# EAGLE design PHAS-AmpController (EAGLE 9.0.1)
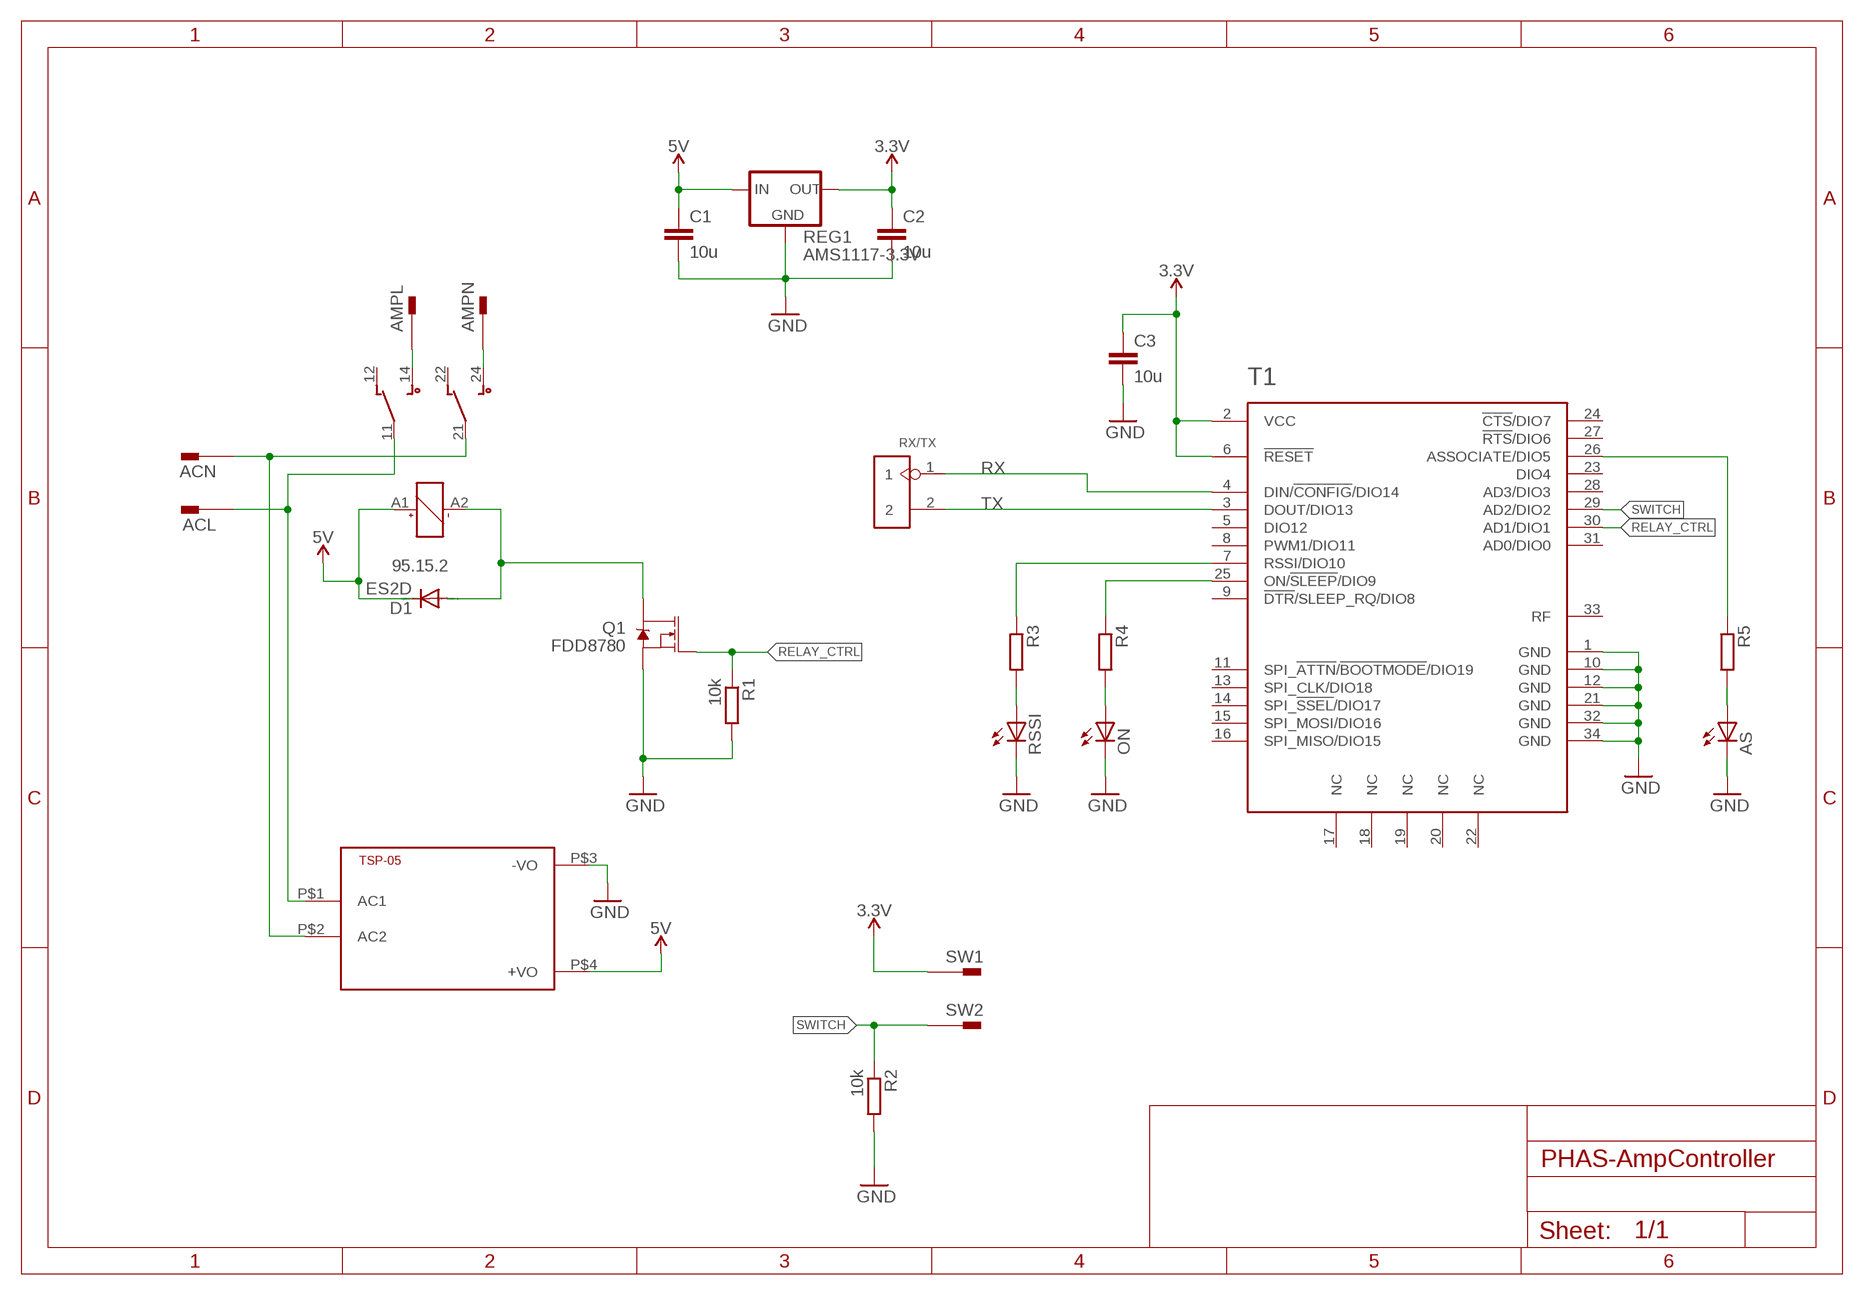
[diagram p0: schematic, sheet 1]

## Parts
ACL  PIN2F061.100  [F061.100]
ACN  PIN2F061.100  [F061.100]
AMPL  PIN2F061.100  [F061.100]
AMPN  PIN2F061.100  [F061.100]
AS  LEDCHIPLED_0805  [CHIPLED_0805]
C1  10u  C-EUC0805  [C0805]
C2  10u  C-EUC0805  [C0805]
C3  10u  C-EUC0805  [C0805]
D1  ES2D  [SMB]
ON  LEDCHIPLED_0805  [CHIPLED_0805]
Q1  FDD8780  MOSFET-NCH-FDD8780  [DPAK]
R1  10k  R-EU_R0805  [R0805]
R2  10k  R-EU_R0805  [R0805]
R3  R-EU_R0805  [R0805]
R4  R-EU_R0805  [R0805]
R5  R-EU_R0805  [R0805]
REG1  AMS1117-3.3V  LM1117MP-3.3  [SOT223]
RL1  95.15.2  [95.15.2]
RSSI  LEDCHIPLED_0805  [CHIPLED_0805]
RX/TX  DIP-BLACK-MALE-HEADER-VERT(2P-2.54)  [H2-2.54]
SW1  PIN2F061.100  [F061.100]
SW2  PIN2F061.100  [F061.100]
T1  XBEE3-MICRO  [XBEE3-MICRO]
TSP-05  HKLPM01  [HKLPM01]

## Nets
3.3V: C2.1 C3.1 REG1.2(OUT) REG1.4(OUT) SW1.A1 SW1.A2 T1.2(VCC) T1.6(!RESET!)
5V: C1.1 D1.C REG1.3(IN) RL1.A1 TSP-05.P$4(+VO)
GND: AS.C C1.2 C2.2 C3.2 ON.C Q1.3(S) R1.2 R2.2 REG1.1(GND) RSSI.C T1.1(GND) T1.10(GND) T1.12(GND) T1.21(GND) T1.32(GND) T1.34(GND) TSP-05.P$3(-VO)
N$2: ACL.A1 ACL.A2 RL1.11 TSP-05.P$1(AC1)
N$3: R3.2 RSSI.A
N$4: ON.A R4.2
N$5: D1.A Q1.4(D) RL1.A2
N$6: AS.A R5.2
N$7: R3.1 T1.7(RSSI/DIO10)
N$8: R4.1 T1.25(ON/!SLEEP!/DIO9)
N$9: R5.1 T1.26(ASSOCIATE/DIO5)
N$10: AMPL.A1 AMPL.A2 RL1.14
N$11: AMPN.A1 AMPN.A2 RL1.24
N$13: ACN.A1 ACN.A2 RL1.21 TSP-05.P$2(AC2)
RELAY_CTRL: Q1.1(G) R1.1 T1.30(AD1/DIO1)
RX: RX/TX.1 T1.4(DIN/!CONFIG!/DIO14)
SWITCH: R2.1 SW2.A1 SW2.A2 T1.29(AD2/DIO2)
TX: RX/TX.2 T1.3(DOUT/DIO13)
Unconnected: RL1.12 RL1.22 T1.5(DIO12) T1.8(PWM1/DIO11) T1.9(!DTR!/SLEEP_RQ/DIO8) T1.11(SPI_!ATTN!/!BOOTMODE!/DIO19) T1.13(SPI_CLK/DIO18) T1.14(SPI_!SSEL!/DIO17) T1.15(SPI_MOSI/DIO16) T1.16(SPI_MISO/DIO15) T1.17(NC) T1.18(NC) T1.19(NC) T1.20(NC) T1.22(NC) T1.23(DIO4) T1.24(!CTS!/DIO7) T1.27(!RTS!/DIO6) T1.28(AD3/DIO3) T1.31(AD0/DIO0) T1.33(RF)

## Library data of the parts
ACL ACN AMPL AMPN SW1 SW2 = con-faston:PIN2: Flachstecker Typ Tyco/Electronics/AMP TAB, FASTON Printed Circuit Board Tabs Source: http://www.buerklin.com, http://catalog.tycoelectronics.com; OC_FARNELL: unknown; OC_NEWARK: unknown
AS ON RSSI = led:LED: LED OSRAM: - CHIPLED LG R971, LG N971, LY N971, LG Q971, LY Q971, LO R971, LY R971 LH N974, LH R974 LS Q976, LO Q976, LY Q976 LO Q996 - Hyper CHIPLED LW Q18S LB Q993, LB Q99A, LB R99A - SideLED LS A670, LO A670, LY A670, LG A670, LP A670 LB A673, LV A673, LT A673, LW A673 LH A674 LY A675 LS A676, LA A676, LO A676, LY A676, LW A676 LS A679, LY A679, LG A679 - Hyper Micro SIDELED® LS Y876, LA Y876, LO Y876, LY Y876 LT Y87S - SmartLED LW L88C, LW L88S LB L89C, LB L89S, LG L890 LS L89K, LO L89K, LY L89K LS L896, LA L896, LO L896, LY L896 - TOPLED LS T670, LO T670, LY T670, LG T670, LP T670 LSG T670, LSP T670, LSY T670, LOP T670, LYG T670 LG T671, LOG T671, LSG T671 LB T673, LV T673, LT T673, LW T673 LH T674 LS T676, LA T676, LO T676, LY T676, LB T676, LH T676, LSB T676, LW T676 LB T67C, LV T67C, LT T67C, LS T67K, LO T67K, LY T67K, LW E67C LS E67B, LA E67B, LO E67B, LY E67B, LB E67C, LV E67C, LT E67C LW T67C LS T679, LY T679, LG T679 LS T770, LO T770, LY T770, LG T770, LP T770 LB T773, LV T773, LT T773, LW T773 LH T774 LS E675, LA E675, LY E675, LS T675 LS T776, LA T776, LO T776, LY T776, LB T776 LHGB T686 LT T68C, LB T68C - Hyper Mini TOPLED® LB M676 - Mini TOPLED Santana® LG M470 LS M47K, LO M47K, LY M47K Source: http://www.osram.convergy.de LUXEON: - LUMILED® LXK2-PW12-R00, LXK2-PW12-S00, LXK2-PW14-U00, LXK2-PW14-V00 LXK2-PM12-R00, LXK2-PM12-S00, LXK2-PM14-U00 LXK2-PE12-Q00, LXK2-PE12-R00, LXK2-PE12-S00, LXK2-PE14-T00, LXK2-PE14-U00 LXK2-PB12-K00, LXK2-PB12-L00, LXK2-PB12-M00, LXK2-PB14-N00, LXK2-PB14-P00, LXK2-PB14-Q00 LXK2-PR12-L00, LXK2-PR12-M00, LXK2-PR14-Q00, LXK2-PR14-R00 LXK2-PD12-Q00, LXK2-PD12-R00, LXK2-PD12-S00 LXK2-PH12-R00, LXK2-PH12-S00 LXK2-PL12-P00, LXK2-PL12-Q00, LXK2-PL12-R00 Source: www.luxeon.com KINGBRIGHT: KA-3528ASYC Source: www.kingbright.com
C1-C3 = resistor:C-EU: CAPACITOR, European symbol
D1 = diode:ES2D: DIODE super fast rectifier, 2 A
Q1 = SparkFun-DiscreteSemi:MOSFET-NCH: N-channel MOSFETs Voltage controlled devices that allow control of high current outputs. SparkFun Products: SparkFun OpenScale <https://www.sparkfun.com/products/13261> SparkFun Digital Sandbox <https://www.sparkfun.com/products/12651> SparkFun Monster Moto Shield <https://www.sparkfun.com/products/10182> SparkFun MOSFET Power Controller <https://www.sparkfun.com/products/11214>; PROD_ID: TRANS-09984; VALUE: 35A/25V/8.5mΩ
R1-R5 = resistor:R-EU_: RESISTOR, European symbol
REG1 = lm1117_10:LM1117?-*: 800mA Low-Dropout Linear Regulator Source: http://www.ti.com/lit/ds/symlink/lm1117-n.pdf; MF: Texas Instruments; MPN: LM1117MP-3.3; OC_FARNELL: 9778195; OC_NEWARK: 28X3416
RL1 = relay_finder:95.15.2: P.C.B. socket suitable for the 40.51 & 40.52 & 40.61 relays
RX/TX = Seeed-Connector:DIP-BLACK-MALE-HEADER-VERT(2P-2.54): 320020016; MPN: P125-1102A0BS116A1; VALUE: 2p-2.54
T1 = xbee3_micro:XBEE3-MICRO
TSP-05 = HKLPM01:HKLPM01

## Board
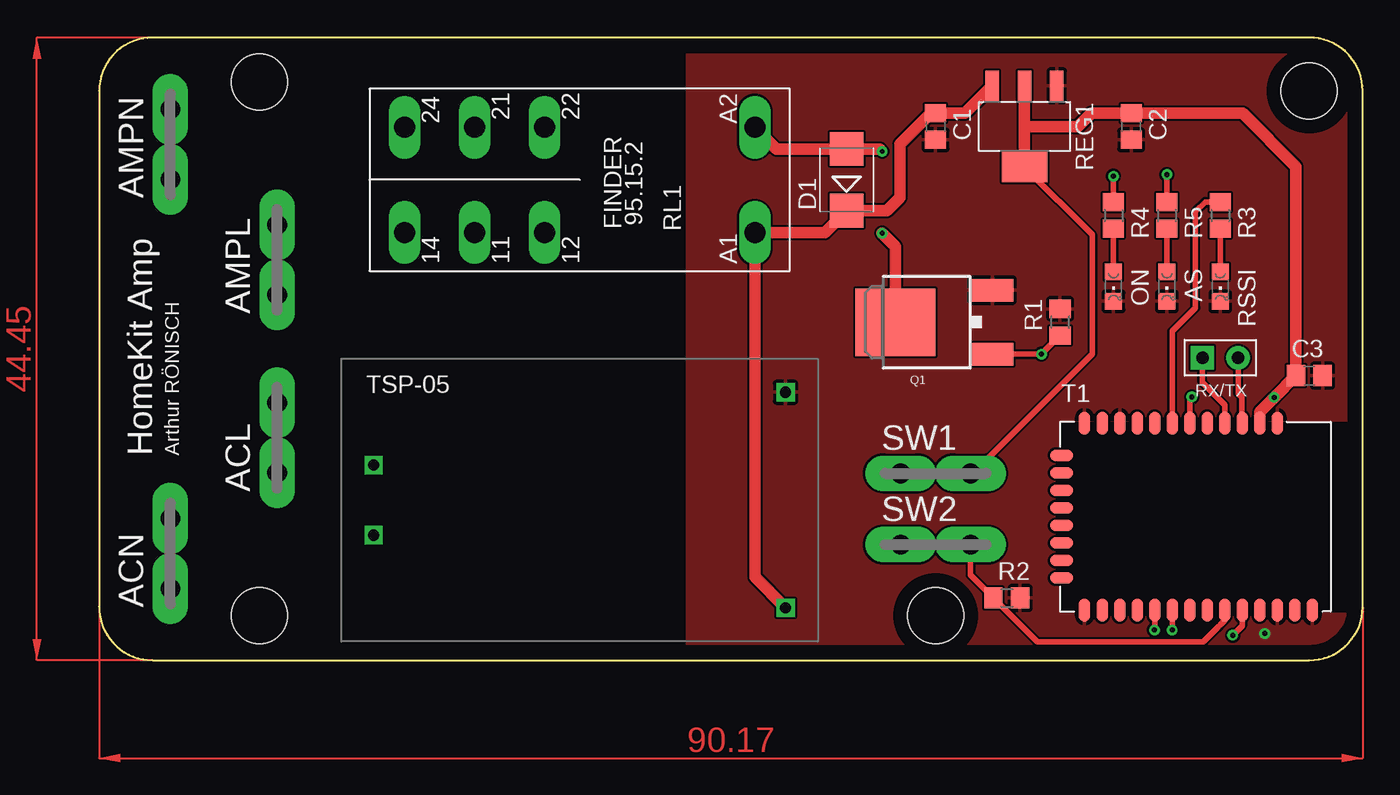
[diagram p1: board, top side]
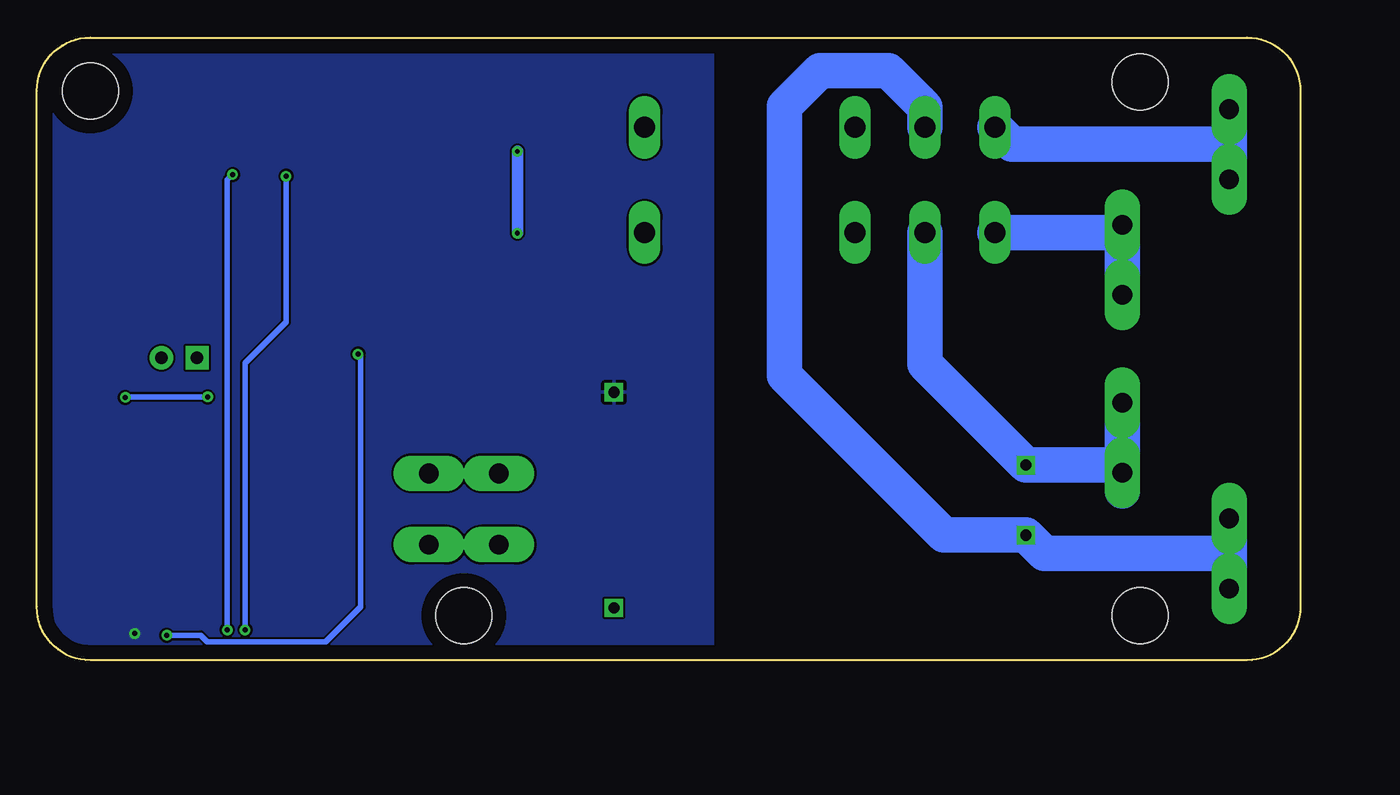
[diagram p2: board, bottom side, seen from below]

Size 90.17 x 44.45 mm. Coordinates in mm from the lower left corner, seen from the top.
Outline: 0,3.81 arc90 3.81,0 86.36,0 arc90 90.17,3.81 90.17,40.64 arc90 86.36,44.45 3.81,44.45 arc90 0,40.64 0,3.81
Copper layers (1*16): Top 0.035mm / dielectric 1.5mm / Bottom 0.035mm
Design rules "default": minimum track width 6mil, minimum drill 0.35mm, track to track 6mil, track to pad 6mil, pad to pad 6mil, via to via 6mil, smd to smd 6mil, copper to edge 40mil, drill to drill 6mil, minimum pad ring 10mil, minimum via ring 8mil, stop-mask expansion 4mil, vias tented up to drill 0mil, thermal gap 10mil
Holes 4 mm at 11.43,3.17 86.36,40.64 11.43,41.27 59.69,3.17
tRestrict: area 68.6,3.4 to 90,17

### Footprints (pad centres in the part's own frame; a part is rotated, then mirrored left to right if it is on the bottom)
F061.100 = drill 1.4 pad 2.54 long: A1 -2.5,0; A2 2.5,0
CHIPLED_0805 = smd 1.2 x 1.2: A 0,-1.05; C 0,1.05
C0805 = smd 1.3 x 1.5: 1 -0.95,0; 2 0.95,0
SMB = smd 2.4 x 2.4: A 2.2,0; C -2.2,0
DPAK = smd 1.6 x 3: 1 -2.28,-5.31; 3 2.28,-5.31 | smd 4.826 x 5.715: 4 0,1.588
R0805 = smd 1.3 x 1.5: 1 -0.95,0; 2 0.95,0
SOT223 = smd 0.95 x 2.15: 1 -2.3,-2.9; 2 0,-2.9; 3 2.3,-2.9 | smd 3.25 x 2.15: 4 0,2.9
95.15.2 = drill 1.5 long: 11 -3.75,7.5; 12 -3.75,2.5; 14 -3.75,12.5; 21 3.75,7.5; 22 3.75,2.5; 24 3.75,12.5; A1 -3.75,-12.5; A2 3.75,-12.5
H2-2.54 = drill 0.889 pad 1.651 square: 1 0,1.27 | drill 0.889 pad 1.651: 2 0,-1.27
XBEE3-MICRO = smd 1.676 x 0.838: 1 0.102,15.494; 2 0.102,14.244; 3 0.102,12.995; 4 0.102,11.745; 5 0.102,10.495; 6 0.102,9.246; 7 0.102,7.996; 8 0.102,6.746; 9 0.102,5.497; 10 0.102,4.247; 11 0.102,2.997; 12 0.102,1.748; 21 13.437,1.748; 22 13.437,2.997; 23 13.437,4.247; 24 13.437,5.497; 25 13.437,6.746; 26 13.437,7.996; 27 13.437,9.246; 28 13.437,10.495; 29 13.437,11.745; 30 13.437,12.995; 31 13.437,14.244; 32 13.437,15.494; 33 13.437,16.744; 34 13.437,17.993 | smd 0.838 x 1.676: 13 2.388,0.102; 14 3.637,0.102; 15 4.887,0.102; 16 6.137,0.102; 17 7.402,0.102; 18 8.651,0.102; 19 9.901,0.102; 20 11.151,0.102
HKLPM01 = drill 0.8 square: P$1 -14.7,2.5; P$2 -14.7,-2.5; P$3 14.7,7.7; P$4 14.7,-7.7

### Placement (x,y rotation side)
ACL  12.7,15.88 90 top
ACN  5.08,7.62 90 top
AMPL  12.7,28.57 90 top
AMPN  5.08,36.83 90 top
AS  76.2,26.67 180 top
C1  59.69,38.1 270 top
C2  73.66,38.1 270 top
C3  86.36,20.32 0 top
D1  53.34,34.29 90 top
ON  72.39,26.67 180 top
Q1  58.42,24.13 90 top
R1  68.58,24.13 90 top
R2  64.77,4.45 0 top
R3  80.01,31.75 270 top
R4  72.39,31.75 270 top
R5  76.2,31.75 270 top
REG1  66.04,38.1 180 top
RL1  34.29,34.29 90 top
RSSI  80.01,26.67 180 top
RX/TX  80.01,21.59 90 top
SW1  59.69,13.34 0 top
SW2  59.69,8.26 0 top
T1  68.58,17.02 270 top
TSP-05  34.29,11.43 0 top

### Tracks (layer width: path | path; a pad name or v marks a point on that pad's centre or on a via)
3.3V  (via drill 0.35)
  Top 0.406: REG1.4 70.87,30.37 70.87,21.84 62.19,13.17 SW1.A2 SW1.A1 | T1.6 77.83,18.64 v77.98,18.8
  Top 0.813: T1.2 82.82,17.73 v83.85,18.76 C3.1 85.41,35.24 81.6,39.05 C2.1 70.8,39.05 69.85,38.1 66.04,38.1 | REG1.2 66.04,38.1 | 66.04,38.1 REG1.4
  Bottom 0.406: v77.98,18.8 83.82,18.8 v83.85,18.76
5V
  Top 0.508: C1.1 59.37,39.05
  Top 0.813: REG1.3 61.79,39.05 C1.1 | 59.37,39.05 57.15,36.83 57.15,33.02 56.22,32.09 D1.C 51.79,30.54 RL1.A1 46.79,5.93 TSP-05.P$4
GND  (via drill 0.35)
  other vias: 83.19,1.91
  pour Top: 41.91,43.81 41.91,0.64 86.36,0.64 arc90 89.53,3.81 89.53,40.64 arc90 86.36,43.81
  pour Bottom: 41.91,43.81 41.91,0.64 86.36,0.64 arc90 89.53,3.81 89.53,40.64 arc90 86.36,43.81
N$2
  Bottom 0.406: ACL.A1 12.7,13.97
  Bottom 2.54: RL1.11 26.79,21.13 TSP-05.P$1 12.74,13.93 12.7,13.97 | 12.7,13.97 12.7,12.06 | 12.7,13.97 ACL.A2
N$3
  Top 0.406: R3.2 RSSI.A
N$4
  Top 0.406: R4.2 ON.A
N$5  (via drill 0.35)
  Top 0.508: v55.88,36.32 55.71,36.49
  Top 0.813: Q1.4 56.83,29.53 v55.88,30.48 | 55.71,36.49 D1.A 48.34,36.49 RL1.A2
  Bottom 0.813: v55.88,30.48 v55.88,36.32
N$6
  Top 0.406: R5.2 AS.A
N$7
  Top 0.406: T1.7 76.58,23.49 78.23,25.15 78.23,32 78.93,32.7 R3.1
N$8  (via drill 0.35)
  Top 0.406: T1.25 75.33,2.17 v75.31,2.16 | v72.39,34.54 R4.1
  Bottom 0.406: v75.31,2.16 75.31,21.21 72.39,24.13 v72.39,34.54
N$9  (via drill 0.35)
  Top 0.406: T1.26 v76.58,2.16 | v76.2,34.67 R5.1
  Bottom 0.406: v76.58,2.16 76.58,34.29 v76.2,34.67
N$10
  Bottom 2.54: AMPL.A1 AMPL.A2 12.73,30.54 RL1.14
N$11
  Bottom 2.54: AMPN.A2 5.08,36.83 | 5.08,36.83 AMPN.A1 | RL1.24 20.58,36.83 5.08,36.83
N$13
  Bottom 0.406: ACN.A1 5.08,4.45
  Bottom 2.54: RL1.21 26.79,39.49 29.39,42.09 34.29,42.09 36.83,39.55 36.83,20.32 25.44,8.93 TSP-05.P$2 | 19.64,8.93 TSP-05.P$2 | ACN.A2 5.08,7.62 | 5.08,4.45 5.08,7.62 | 5.08,7.62 18.28,7.62 TSP-05.P$2
RELAY_CTRL  (via drill 0.35)
  Top 0.406: Q1.1 v67.25,21.85 R1.1 | T1.30 81.58,2.45 v80.9,1.78
  Bottom 0.406: v80.9,1.78 78.49,1.78 78,1.29 69.57,1.29 67.06,3.81 67.06,21.66 v67.25,21.85
RX
  Top 0.406: T1.4 80.33,18.23 78.74,19.81 RX/TX.1
SWITCH
  Top 0.406: 80.02,2.54 79.85,2.37 79.85,2.33 78.81,1.29 66.97,1.29 64.71,3.55 R2.1 62.19,6.08 SW2.A2 SW2.A1 | 80.02,2.54 80.33,2.85 T1.29 | 80.02,2.54 80.01,2.54
TX
  Top 0.406: T1.3 81.53,16.45 81.53,18.8 81.28,19.05 RX/TX.2
(copper drawn outside any net)
  shapes: Top area x2

### Text on the board
tNames: HomeKit Amp | Arthur RÖNISCH